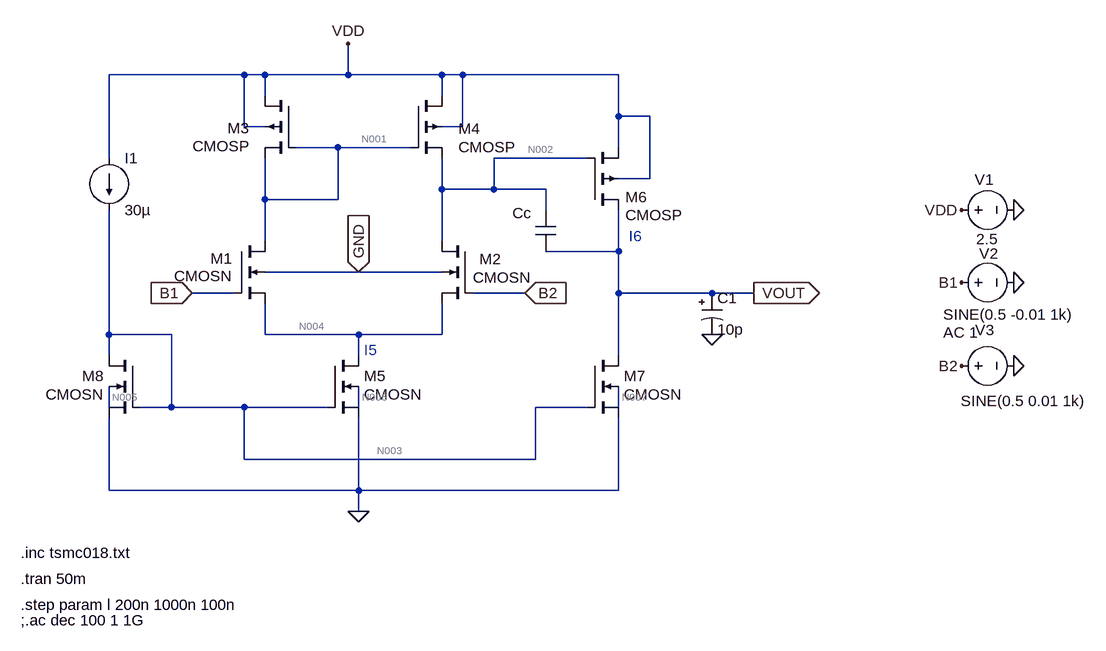
[diagram p0: schematic machtt.asc]
machtt.asc, the LTspice schematic file:
Version 4
SHEET 1 2120 948
WIRE 384 -32 176 -32
WIRE 416 -32 384 -32
WIRE 544 -32 544 -80
WIRE 544 -32 416 -32
WIRE 688 -32 544 -32
WIRE 720 -32 688 -32
WIRE 960 -32 720 -32
WIRE 416 0 416 -32
WIRE 688 0 688 -32
WIRE 960 32 960 -32
WIRE 1008 32 960 32
WIRE 384 48 384 -32
WIRE 416 48 384 48
WIRE 720 48 720 -32
WIRE 720 48 688 48
WIRE 528 80 464 80
WIRE 640 80 528 80
WIRE 960 80 960 32
WIRE 176 96 176 -32
WIRE 912 96 768 96
WIRE 1008 128 1008 32
WIRE 1008 128 960 128
WIRE 688 144 688 96
WIRE 768 144 768 96
WIRE 768 144 688 144
WIRE 848 144 768 144
WIRE 416 160 416 96
WIRE 528 160 528 80
WIRE 528 160 416 160
WIRE 848 176 848 144
WIRE 416 224 416 160
WIRE 688 224 688 144
WIRE 960 240 960 176
WIRE 960 240 848 240
WIRE 560 272 416 272
WIRE 688 272 560 272
WIRE 368 304 304 304
WIRE 816 304 736 304
WIRE 960 304 960 240
WIRE 1104 304 960 304
WIRE 1168 304 1104 304
WIRE 176 368 176 176
WIRE 272 368 176 368
WIRE 416 368 416 320
WIRE 560 368 416 368
WIRE 688 368 688 320
WIRE 688 368 560 368
WIRE 176 400 176 368
WIRE 560 400 560 368
WIRE 960 400 960 304
WIRE 176 480 176 448
WIRE 272 480 272 368
WIRE 272 480 224 480
WIRE 384 480 272 480
WIRE 512 480 384 480
WIRE 560 480 560 448
WIRE 912 480 832 480
WIRE 960 480 960 448
WIRE 384 560 384 480
WIRE 832 560 832 480
WIRE 832 560 384 560
WIRE 176 608 176 496
WIRE 560 608 560 496
WIRE 560 608 176 608
WIRE 960 608 960 496
WIRE 960 608 560 608
WIRE 560 640 560 608
FLAG 304 304 B1
IOPIN 304 304 In
FLAG 816 304 B2
IOPIN 816 304 In
FLAG 1168 304 VOUT
IOPIN 1168 304 Out
FLAG 560 272 GND
IOPIN 560 272 In
FLAG 560 640 0
FLAG 1568 176 0
FLAG 1568 416 0
FLAG 1568 288 0
FLAG 1488 176 VDD
FLAG 1488 288 B1
FLAG 1488 416 B2
FLAG 544 -80 VDD
FLAG 1104 368 0
SYMBOL nmos4 224 400 M0
WINDOW 3 56 60 Left 2
SYMATTR Value CMOSN
SYMATTR Value2 l=l w=6l
SYMATTR InstName M8
SYMBOL pmos4 464 0 M0
WINDOW 0 72 50 Left 2
WINDOW 3 72 78 Left 2
SYMATTR InstName M3
SYMATTR Value CMOSP
SYMATTR Value2 l=l w=30l
SYMBOL pmos4 640 0 R0
WINDOW 0 74 51 Left 2
WINDOW 3 74 79 Left 2
SYMATTR InstName M4
SYMATTR Value CMOSP
SYMATTR Value2 l=l w=30l
SYMBOL nmos4 368 224 R0
WINDOW 0 -36 27 Left 2
WINDOW 3 -92 54 Left 2
SYMATTR InstName M1
SYMATTR Value CMOSN
SYMATTR Value2 l=l w=3l
SYMBOL nmos4 736 224 M0
WINDOW 0 -44 28 Left 2
WINDOW 3 -89 56 Left 2
SYMATTR InstName M2
SYMATTR Value CMOSN
SYMATTR Value2 l=l w=3l
SYMBOL nmos4 512 400 R0
WINDOW 3 56 60 Left 2
SYMATTR Value CMOSN
SYMATTR Value2 l=l w=6l
SYMATTR InstName M5
SYMBOL nmos4 912 400 R0
WINDOW 3 56 60 Left 2
SYMATTR Value CMOSN
SYMATTR Value2 l=l w=20l
SYMATTR InstName M7
SYMBOL pmos4 912 176 M180
WINDOW 0 59 20 Left 2
WINDOW 3 59 -8 Left 2
SYMATTR InstName M6
SYMATTR Value CMOSP
SYMATTR Value2 l=l w=190l
SYMBOL cap 832 176 R0
WINDOW 3 -37 44 Invisible 2
WINDOW 0 -35 5 Left 2
SYMATTR Value 3p
SYMATTR InstName Cc
SYMBOL current 176 96 R0
WINDOW 123 0 0 Left 0
WINDOW 39 0 0 Left 0
SYMATTR InstName I1
SYMATTR Value 30µ
SYMBOL voltage 1472 176 R270
WINDOW 123 0 0 Left 0
WINDOW 39 0 0 Left 0
WINDOW 0 47 36 VRight 2
WINDOW 3 -45 39 VRight 2
SYMATTR InstName V1
SYMATTR Value 2.5
SYMBOL voltage 1472 288 R270
WINDOW 0 45 43 VRight 2
WINDOW 3 -49 -12 VRight 2
WINDOW 123 -77 -12 VRight 2
WINDOW 39 0 0 Left 0
SYMATTR InstName V2
SYMATTR Value SINE(0.5 -0.01 1k)
SYMATTR Value2 AC 1
SYMBOL voltage 1472 416 R270
WINDOW 123 -20 122 VRight 2
WINDOW 39 0 0 Left 0
WINDOW 0 55 37 VRight 2
WINDOW 3 -54 15 VRight 2
SYMATTR InstName V3
SYMATTR Value SINE(0.5 0.01 1k)
SYMBOL polcap 1088 304 R0
SYMATTR InstName C1
SYMATTR Value 10p
TEXT 40 704 Left 2 !.inc tsmc018.txt
TEXT 40 744 Left 2 !.tran 50m
TEXT 40 784 Left 2 !.step param l 200n 1000n 100n
TEXT 568 392 Left 2 ;I5
TEXT 976 216 Left 2 ;I6
TEXT 40 808 Left 2 !;.ac dec 100 1 1G

The netlist it stands for:
* machtt.asc
M8 N003 N003 0 N005 CMOSN l=l w=6l
M3 VDD N001 N001 VDD CMOSP l=l w=30l
M4 VDD N001 N002 VDD CMOSP l=l w=30l
M1 N001 B1 N004 GND CMOSN l=l w=3l
M2 N002 B2 N004 GND CMOSN l=l w=3l
M5 N004 N003 0 N006 CMOSN l=l w=6l
M7 VOUT N003 0 N007 CMOSN l=l w=20l
M6 VOUT N002 VDD VDD CMOSP l=l w=190l
Cc N002 VOUT 3p
I1 VDD N003 30µ
V1 VDD 0 2.5
V2 B1 0 SINE(0.5 -0.01 1k) AC 1
V3 B2 0 SINE(0.5 0.01 1k)
C1 VOUT 0 10p
.model NMOS NMOS
.model PMOS PMOS
.lib standard.mos
.inc tsmc018.txt
.tran 50m
.step param l 200n 1000n 100n
* I5
* I6
;.ac dec 100 1 1G
.backanno
.end

* Results of the author's LTspice run, read from the files saved beside the schematic
* Operating Point (first step), zero values left out:
*   l = 200 n
*   V(n003) = 32.11 mV
*   V(n005) = 10.84 mV
*   V(vdd) = 2.5 V
*   V(n001) = 2.489 V
*   V(n002) = 2.489 V
*   V(b1) = 500 mV
*   V(n004) = 374.3 mV
*   V(b2) = 500 mV
*   V(n006) = 73.75 mV
*   V(vout) = 1.838 V
*   V(n007) = 129.1 mV
*   Id(M8) = 30 µA
*   Is(M8) = -30 µA
*   Id(M1) = 47.42 µA
*   Ib(M1) = -2.884 pA
*   Is(M1) = -47.42 µA
*   Id(M2) = 47.42 µA
*   Ib(M2) = -2.884 pA
*   Is(M2) = -47.42 µA
*   Id(M5) = 94.83 µA
*   Is(M5) = -94.83 µA
*   Id(M7) = 1.099 mA
*   Is(M7) = -1.099 mA
*   Id(M3) = 47.42 µA
*   Is(M3) = -47.42 µA
*   Id(M4) = 47.42 µA
*   Is(M4) = -47.42 µA
*   Id(M6) = -1.099 mA
*   Is(M6) = 1.099 mA
*   I(I1) = 30 µA
*   I(V1) = -1.224 mA